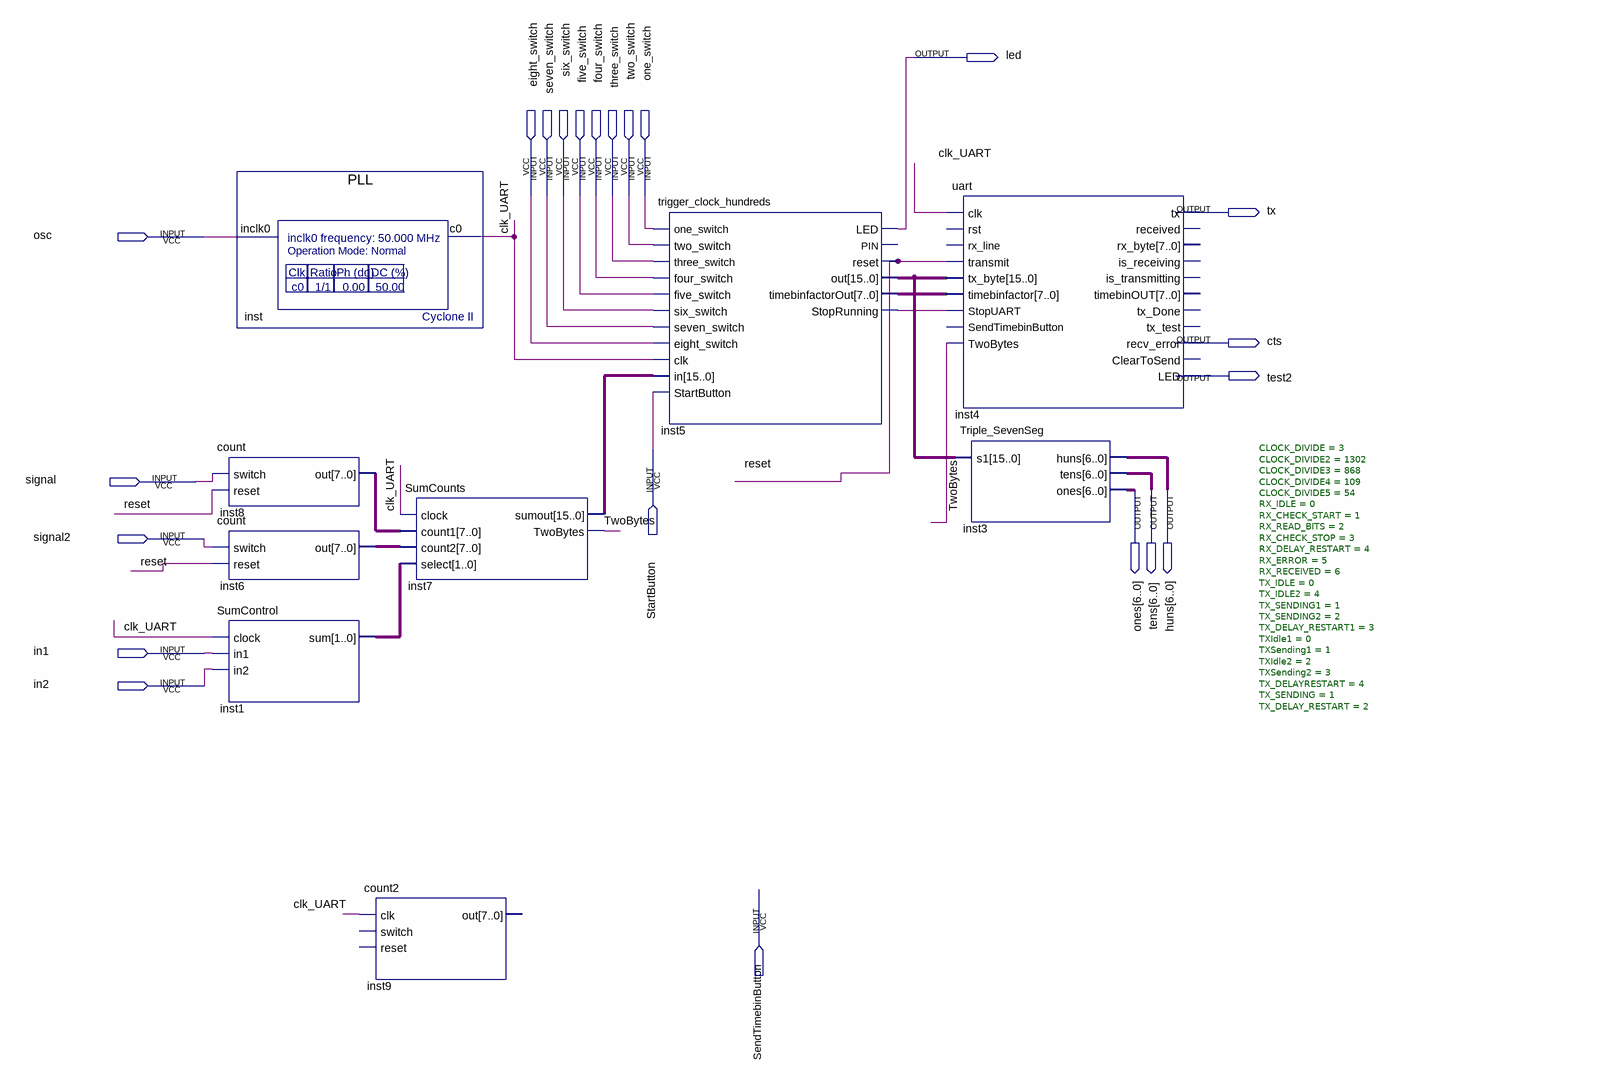
[diagram p0: schematic sheet]
// Quartus schematic PMT_Timebin_Counts.bdf as structural Verilog: 9 symbols, 22 pins
module PMT_Timebin_Counts (
  input  eight_switch,
  input  seven_switch,
  input  six_switch,
  input  five_switch,
  input  four_switch,
  input  three_switch,
  input  two_switch,
  input  one_switch,
  input  osc,
  input  StartButton,
  input  signal,
  input  signal2,
  input  in1,
  input  in2,
  input  SendTimebinButton,
  output led,
  output tx,
  output cts,
  output test2,
  output [6:0] ones,
  output [6:0] tens,
  output [6:0] huns
);

  wire clk_UART, inst5_stoprunning, reset, TwoBytes;
  wire [1:0] inst1_sum;
  wire [7:0] inst5_timebinfactorout, inst6_out, inst8_out;
  wire [15:0] inst5_out, inst7_sumout;

  PLL inst (.inclk0(osc), .c0(clk_UART));
  count inst8 (.switch(signal), .reset(reset), .out(inst8_out));
  count inst6 (.switch(signal2), .reset(reset), .out(inst6_out));
  SumControl inst1 (.clock(clk_UART), .in1(in1), .in2(in2), .sum(inst1_sum));
  count2 inst9 (.clk(clk_UART));  // open: switch, reset, out
  SumCounts inst7 (
    .clock(clk_UART), .count1(inst8_out), .count2(inst6_out), .select(inst1_sum), .sumout(inst7_sumout),
    .TwoBytes(TwoBytes));
  trigger_clock_hundreds inst5 (
    .one_switch(one_switch), .two_switch(two_switch), .three_switch(three_switch), .four_switch(four_switch),
    .five_switch(five_switch), .six_switch(six_switch), .seven_switch(seven_switch),
    .eight_switch(eight_switch), .clk(clk_UART), .in(inst7_sumout), .StartButton(StartButton), .LED(led),
    .reset(reset), .out(inst5_out), .timebinfactorOut(inst5_timebinfactorout), .StopRunning(inst5_stoprunning));  // open: PIN
  uart #(.CLOCK_DIVIDE(3), .CLOCK_DIVIDE2(1302), .CLOCK_DIVIDE3(868), .CLOCK_DIVIDE4(109), .CLOCK_DIVIDE5(54), .RX_IDLE(0), .RX_CHECK_START(1), .RX_READ_BITS(2), .RX_CHECK_STOP(3), .RX_DELAY_RESTART(4), .RX_ERROR(5), .RX_RECEIVED(6), .TX_IDLE(0), .TX_IDLE2(4), .TX_SENDING1(1), .TX_SENDING2(2), .TX_DELAY_RESTART1(3), .TXIdle1(0), .TXSending1(1), .TXIdle2(2), .TXSending2(3), .TX_DELAYRESTART(4), .TX_SENDING(1), .TX_DELAY_RESTART(2)) inst4 (
    .clk(clk_UART), .transmit(reset), .tx_byte(inst5_out), .timebinfactor(inst5_timebinfactorout),
    .StopUART(inst5_stoprunning), .TwoBytes(TwoBytes), .tx(tx), .recv_error(cts), .LED(test2));  // open: rst, rx_line, SendTimebinButton, received, rx_byte, is_receiving, is_transmitting, timebinOUT, tx_Done, tx_test, ClearToSend
  Triple_SevenSeg inst3 (.s1(inst5_out), .huns(huns), .tens(tens), .ones(ones));
endmodule
